# EAGLE schematic LED_CUBE_595 (EAGLE 7.7.0)
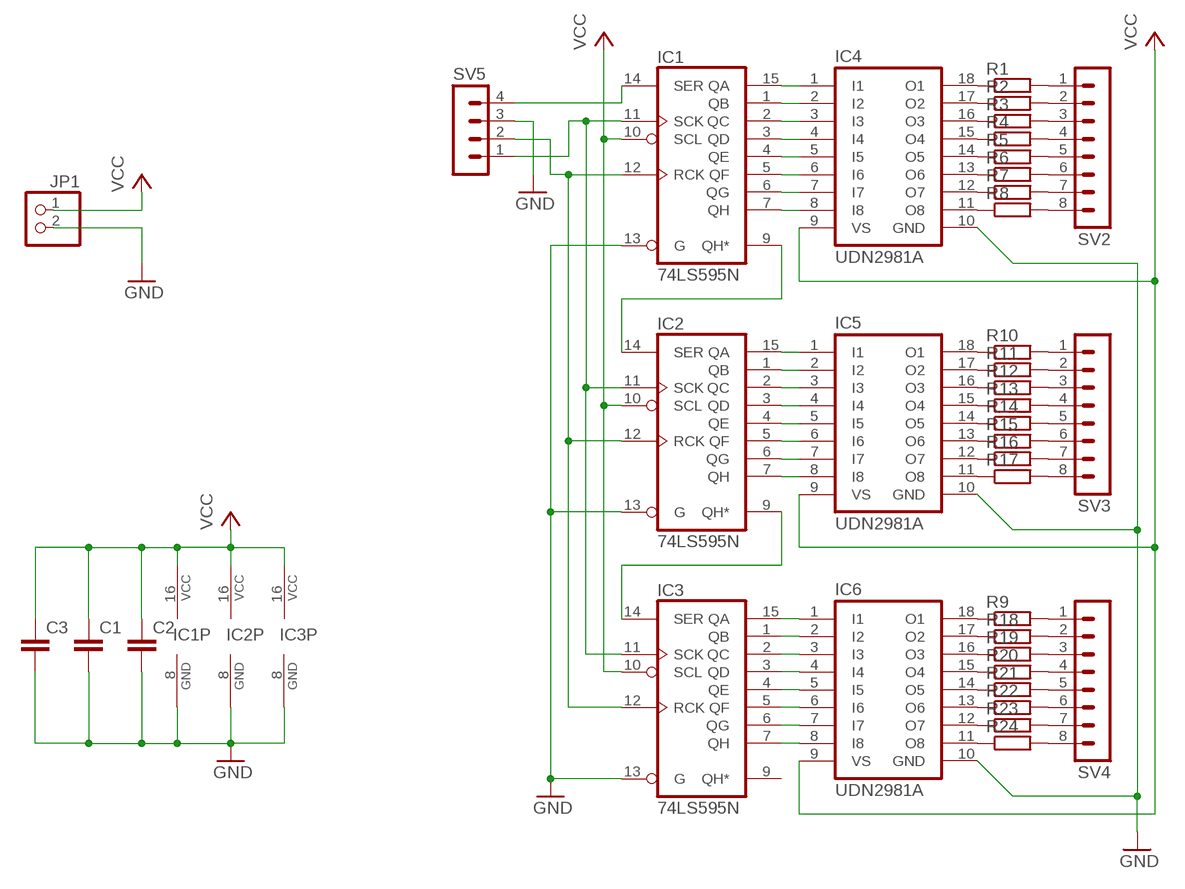
[diagram p0: schematic, sheet 1]

## Parts
C1  C-EU025-025X050  [C025-025X050]
C2  C-EU025-025X050  [C025-025X050]
C3  C-EU025-025X050  [C025-025X050]
IC1  74LS595N  [DIL16]
IC2  74LS595N  [DIL16]
IC3  74LS595N  [DIL16]
IC4  UDN2981A  [DIL18]
IC5  UDN2981A  [DIL18]
IC6  UDN2981A  [DIL18]
JP1  PINHD-1X2  [1X02]
R1  R-EU_0204/2V  [0204V]
R2  R-EU_0204/2V  [0204V]
R3  R-EU_0204/2V  [0204V]
R4  R-EU_0204/2V  [0204V]
R5  R-EU_0204/2V  [0204V]
R6  R-EU_0204/2V  [0204V]
R7  R-EU_0204/2V  [0204V]
R8  R-EU_0204/2V  [0204V]
R9  R-EU_0204/2V  [0204V]
R10  R-EU_0204/2V  [0204V]
R11  R-EU_0204/2V  [0204V]
R12  R-EU_0204/2V  [0204V]
R13  R-EU_0204/2V  [0204V]
R14  R-EU_0204/2V  [0204V]
R15  R-EU_0204/2V  [0204V]
R16  R-EU_0204/2V  [0204V]
R17  R-EU_0204/2V  [0204V]
R18  R-EU_0204/2V  [0204V]
R19  R-EU_0204/2V  [0204V]
R20  R-EU_0204/2V  [0204V]
R21  R-EU_0204/2V  [0204V]
R22  R-EU_0204/2V  [0204V]
R23  R-EU_0204/2V  [0204V]
R24  R-EU_0204/2V  [0204V]
SV2  MA08-1  [MA08-1]
SV3  MA08-1  [MA08-1]
SV4  MA08-1  [MA08-1]
SV5  MA04-1  [MA04-1]

## Nets
GND: C1.2 C2.2 C3.2 IC1.8(GND) IC1.13(G) IC2.8(GND) IC2.13(G) IC3.8(GND) IC3.13(G) IC4.10(GND) IC5.10(GND) IC6.10(GND) JP1.2 SV5.3
N$1: IC1.9(QH*) IC2.14(SER)
N$2: IC1.15(QA) IC4.1(I1)
N$3: IC1.1(QB) IC4.2(I2)
N$4: IC1.2(QC) IC4.3(I3)
N$5: IC1.3(QD) IC4.4(I4)
N$6: IC1.4(QE) IC4.5(I5)
N$7: IC1.5(QF) IC4.6(I6)
N$8: IC1.6(QG) IC4.7(I7)
N$9: IC1.7(QH) IC4.8(I8)
N$10: IC2.15(QA) IC5.1(I1)
N$11: IC2.1(QB) IC5.2(I2)
N$12: IC2.2(QC) IC5.3(I3)
N$13: IC2.3(QD) IC5.4(I4)
N$14: IC2.4(QE) IC5.5(I5)
N$15: IC2.5(QF) IC5.6(I6)
N$16: IC2.6(QG) IC5.7(I7)
N$17: IC2.7(QH) IC5.8(I8)
N$18: IC4.18(O1) R1.1
N$19: IC4.17(O2) R2.1
N$20: IC4.16(O3) R3.1
N$21: IC4.15(O4) R4.1
N$22: IC4.14(O5) R5.1
N$23: IC4.13(O6) R6.1
N$24: IC4.12(O7) R7.1
N$25: IC4.11(O8) R8.1
N$26: R1.2 SV2.1
N$27: IC1.11(SCK) IC2.11(SCK) IC3.11(SCK) SV5.1
N$28: IC1.14(SER) SV5.4
N$29: IC1.12(RCK) IC2.12(RCK) IC3.12(RCK) SV5.2
N$30: IC2.9(QH*) IC3.14(SER)
N$32: IC5.17(O2) R11.1
N$33: IC5.16(O3) R12.1
N$34: IC5.15(O4) R13.1
N$35: IC5.14(O5) R14.1
N$36: IC5.13(O6) R15.1
N$37: IC5.12(O7) R16.1
N$38: IC5.11(O8) R17.1
N$39: R2.2 SV2.2
N$40: IC5.18(O1) R10.1
N$41: R3.2 SV2.3
N$42: R4.2 SV2.4
N$43: R5.2 SV2.5
N$44: R6.2 SV2.6
N$45: R7.2 SV2.7
N$46: R8.2 SV2.8
N$47: R10.2 SV3.1
N$48: R11.2 SV3.2
N$49: R12.2 SV3.3
N$50: R13.2 SV3.4
N$51: R14.2 SV3.5
N$52: R15.2 SV3.6
N$53: R16.2 SV3.7
N$54: R17.2 SV3.8
N$55: IC6.18(O1) R9.1
N$56: IC6.17(O2) R18.1
N$57: IC6.16(O3) R19.1
N$58: IC6.15(O4) R20.1
N$59: IC6.14(O5) R21.1
N$60: IC6.13(O6) R22.1
N$61: IC6.12(O7) R23.1
N$62: IC6.11(O8) R24.1
N$63: R9.2 SV4.1
N$64: R18.2 SV4.2
N$65: R19.2 SV4.3
N$66: R20.2 SV4.4
N$67: R21.2 SV4.5
N$68: R22.2 SV4.6
N$69: R23.2 SV4.7
N$70: R24.2 SV4.8
N$73: IC3.15(QA) IC6.1(I1)
N$74: IC3.1(QB) IC6.2(I2)
N$75: IC3.2(QC) IC6.3(I3)
N$76: IC3.3(QD) IC6.4(I4)
N$77: IC3.4(QE) IC6.5(I5)
N$78: IC3.5(QF) IC6.6(I6)
N$79: IC3.6(QG) IC6.7(I7)
N$80: IC3.7(QH) IC6.8(I8)
VCC: C1.1 C2.1 C3.1 IC1.10(SCL) IC1.16(VCC) IC2.10(SCL) IC2.16(VCC) IC3.10(SCL) IC3.16(VCC) IC4.9(VS) IC5.9(VS) IC6.9(VS) JP1.1
Unconnected: IC3.9(QH*)

## Library data of the parts
C1-C3 = rcl:C-EU: CAPACITOR, European symbol
IC1-IC3 = 74xx-us:74*595: 8-bit SHIFT REGISTER, output latch
IC4-IC6 = uln-udn:UDN298*: DRIVER ARRAY Source: Allegro Microsystems Inc. / UDN2981-UDN2984.pdf
JP1 = pinhead:PINHD-1X2: PIN HEADER
R1-R24 = rcl:R-EU_: RESISTOR, European symbol
SV2-SV4 = con-lstb:MA08-1: PIN HEADER; OC_FARNELL: unknown; OC_NEWARK: unknown
SV5 = con-lstb:MA04-1: PIN HEADER; OC_FARNELL: unknown; OC_NEWARK: unknown